# Altium schematic sheet 05_Mechanical.SchDoc: Mechanicals
size A; Revision: A; SheetNumber: 5; SheetTotal: 8; ECE315_Project_Name: ECE453 MCU Base Project
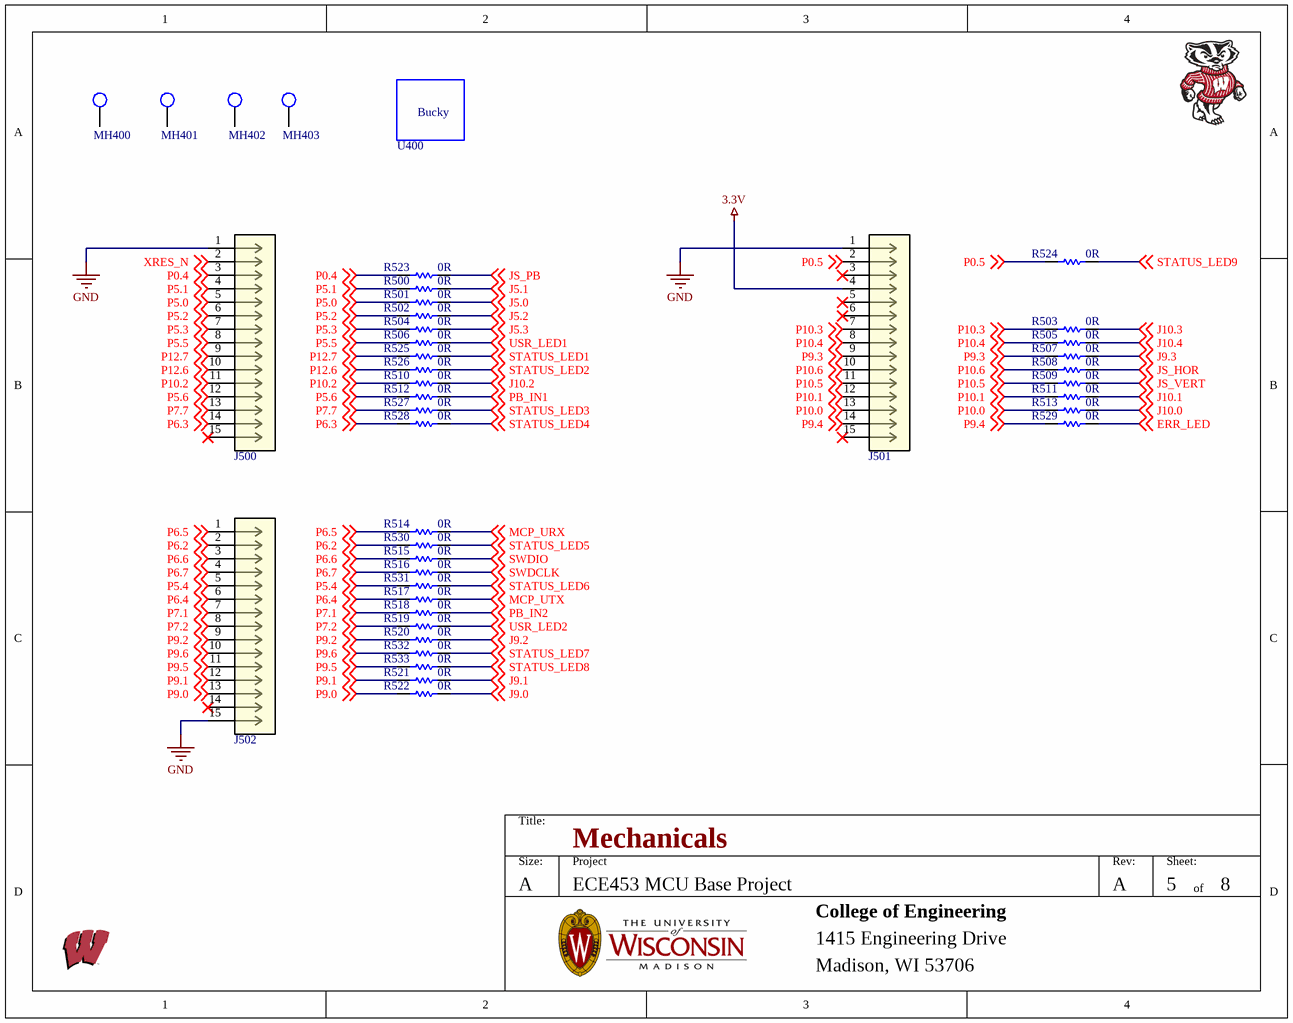
[diagram p0: 05_Mechanical.SchDoc]

## Parts
J500  68000-115HLF  [CONN_15POS_2P54MM]  (value not drawn)
J501  68000-115HLF  [CONN_15POS_2P54MM]  (value not drawn)
J502  68000-115HLF  [CONN_15POS_2P54MM]  (value not drawn)
MH400  MHOLE_2_55MM  [MHOLE_2_55MM]  (value not drawn)
MH401  MHOLE_2_55MM  [MHOLE_2_55MM]  (value not drawn)
MH402  MHOLE_2_55MM  [MHOLE_2_55MM]  (value not drawn)
MH403  MHOLE_2_55MM  [MHOLE_2_55MM]  (value not drawn)
R500  0R  [RESC2013X70X40NL20T20]
R501  0R  [RESC2013X70X40NL20T20]
R502  0R  [RESC2013X70X40NL20T20]
R503  0R  [RESC2013X70X40NL20T20]
R504  0R  [RESC2013X70X40NL20T20]
R505  0R  [RESC2013X70X40NL20T20]
R506  0R  [RESC2013X70X40NL20T20]
R507  0R  [RESC2013X70X40NL20T20]
R508  0R  [RESC2013X70X40NL20T20]
R509  0R  [RESC2013X70X40NL20T20]
R510  0R  [RESC2013X70X40NL20T20]
R511  0R  [RESC2013X70X40NL20T20]
R512  0R  [RESC2013X70X40NL20T20]
R513  0R  [RESC2013X70X40NL20T20]
R514  0R  [RESC2013X70X40NL20T20]
R515  0R  [RESC2013X70X40NL20T20]
R516  0R  [RESC2013X70X40NL20T20]
R517  0R  [RESC2013X70X40NL20T20]
R518  0R  [RESC2013X70X40NL20T20]
R519  0R  [RESC2013X70X40NL20T20]
R520  0R  [RESC2013X70X40NL20T20]
R521  0R  [RESC2013X70X40NL20T20]
R522  0R  [RESC2013X70X40NL20T20]
R523  0R  [RESC2013X70X40NL20T20]
R524  0R  [RESC2013X70X40NL20T20]
R525  0R  [RESC2013X70X40NL20T20]
R526  0R  [RESC2013X70X40NL20T20]
R527  0R  [RESC2013X70X40NL20T20]
R528  0R  [RESC2013X70X40NL20T20]
R529  0R  [RESC2013X70X40NL20T20]
R530  0R  [RESC2013X70X40NL20T20]
R531  0R  [RESC2013X70X40NL20T20]
R532  0R  [RESC2013X70X40NL20T20]
R533  0R  [RESC2013X70X40NL20T20]
U400  Bucky  [WalkingBucky]  (value not drawn)  (no BOM)

## Nets
3.3V: J501.4
GND: J500.1 J501.1 J502.15
ERR_LED: R529.2 ; off-sheet ERR_LED
J5.0: R501.2 ; off-sheet J5.0
J5.1: R500.2 ; off-sheet J5.1
J5.2: R502.2 ; off-sheet J5.2
J5.3: R504.2 ; off-sheet J5.3
J9.0: R522.2 ; off-sheet J9.0
J9.1: R521.2 ; off-sheet J9.1
J9.2: R520.2 ; off-sheet J9.2
J9.3: R507.2 ; off-sheet J9.3
J10.0: R513.2 ; off-sheet J10.0
J10.1: R511.2 ; off-sheet J10.1
J10.2: R510.2 ; off-sheet J10.2
J10.3: R503.2 ; off-sheet J10.3
J10.4: R505.2 ; off-sheet J10.4
JS_HOR: R508.2 ; off-sheet JS_HOR
JS_PB: R523.2 ; off-sheet JS_PB
JS_VERT: R509.2 ; off-sheet JS_VERT
MCP_URX: R514.2 ; off-sheet MCP_URX
MCP_UTX: R517.2 ; off-sheet MCP_UTX
P0.4: J500.3 R523.1 ; off-sheet P0.4
P0.5: J501.2 R524.1 ; off-sheet P0.5
P5.0: J500.5 R501.1 ; off-sheet P5.0
P5.1: J500.4 R500.1 ; off-sheet P5.1
P5.2: J500.6 R502.1 ; off-sheet P5.2
P5.3: J500.7 R504.1 ; off-sheet P5.3
P5.4: J502.5 R531.1 ; off-sheet P5.4
P5.5: J500.8 R506.1 ; off-sheet P5.5
P5.6: J500.12 R512.1 ; off-sheet P5.6
P6.2: J502.2 R530.1 ; off-sheet P6.2
P6.3: J500.14 R528.1 ; off-sheet P6.3
P6.4: J502.6 R517.1 ; off-sheet P6.4
P6.5: J502.1 R514.1 ; off-sheet P6.5
P6.6: J502.3 R515.1 ; off-sheet P6.6
P6.7: J502.4 R516.1 ; off-sheet P6.7
P7.1: J502.7 R518.1 ; off-sheet P7.1
P7.2: J502.8 R519.1 ; off-sheet P7.2
P7.7: J500.13 R527.1 ; off-sheet P7.7
P9.0: J502.13 R522.1 ; off-sheet P9.0
P9.1: J502.12 R521.1 ; off-sheet P9.1
P9.2: J502.9 R520.1 ; off-sheet P9.2
P9.3: J501.9 R507.1 ; off-sheet P9.3
P9.4: J501.14 R529.1 ; off-sheet P9.4
P9.5: J502.11 R533.1 ; off-sheet P9.5
P9.6: J502.10 R532.1 ; off-sheet P9.6
P10.0: J501.13 R513.1 ; off-sheet P10.0
P10.1: J501.12 R511.1 ; off-sheet P10.1
P10.2: J500.11 R510.1 ; off-sheet P10.2
P10.3: J501.7 R503.1 ; off-sheet P10.3
P10.4: J501.8 R505.1 ; off-sheet P10.4
P10.5: J501.11 R509.1 ; off-sheet P10.5
P10.6: J501.10 R508.1 ; off-sheet P10.6
P12.6: J500.10 R526.1 ; off-sheet P12.6
P12.7: J500.9 R525.1 ; off-sheet P12.7
PB_IN1: R512.2 ; off-sheet PB_IN1
PB_IN2: R518.2 ; off-sheet PB_IN2
STATUS_LED1: R525.2 ; off-sheet STATUS_LED1
STATUS_LED2: R526.2 ; off-sheet STATUS_LED2
STATUS_LED3: R527.2 ; off-sheet STATUS_LED3
STATUS_LED4: R528.2 ; off-sheet STATUS_LED4
STATUS_LED5: R530.2 ; off-sheet STATUS_LED5
STATUS_LED6: R531.2 ; off-sheet STATUS_LED6
STATUS_LED7: R532.2 ; off-sheet STATUS_LED7
STATUS_LED8: R533.2 ; off-sheet STATUS_LED8
STATUS_LED9: R524.2 ; off-sheet STATUS_LED9
SWDCLK: R516.2 ; off-sheet SWDCLK
SWDIO: R515.2 ; off-sheet SWDIO
USR_LED1: R506.2 ; off-sheet USR_LED1
USR_LED2: R519.2 ; off-sheet USR_LED2
XRES_N: J500.2 ; off-sheet XRES_N

Not connected (* = marked no-connect by the designer): J500 15*; J501 3* 5* 6* 15*; J502 14*; MH400 1; MH401 1; MH402 1; MH403 1

## Notes on the sheet
- Title:
- Size:
- A
- Project
- Rev:
- Sheet:
- of
- College of Engineering
- 1415 Engineering Drive
- Madison, WI 53706

## Library data of the parts
J500-J502 = CONN_HEADER_POS_30_2.54MM: Conn Unshrouded Header HDR 15 POS 2.54mm Solder ST Thru-Hole; Mfr_Name: Amphenol ICC; Manufacturer: Adam Equipment; Manufacturer Part Number: PH1-15-UA; Copyright: Copyright (C) 2024 Ultra Librarian. All rights reserved.; Manufacturer_Part_Number: 68000-115HLF; RefDes: RefDes; Type: DEV; Supplier: Digikey; Supplier Part Number: 2057-PH1-15-UA-ND; RoHS: No; Category: Connectors; Stock: 2835; Pricing: 1=0.18, 10=0.15, 100=0.1157, 500=0.09788, 1000=0.08008, 5000=0.07118, 10000=0.06451 (USD)
MH400-MH403 = MHOLE_2_55MM: Mounting Holde; Manufacturer Part Number: UW MTHOLE
R500-R533 = CMP-1665-00002-5: Chip Resistor, 0 Ohm, +/- 1%, 0.125 W, -55 to 155 degC, 0805 (2012 Metric), RoHS, Tape and Reel; PartNumber: ERJ-6GEY0R00V; Tolerance: 5%; Resistance: 0 Ohm; REACH SVHC: No SVHC; Min Operating Temperature: -55 degC; Case/Package: 0805; Packaging: Tape and Reel; Package Quantity: 5000; ComponentLink1Description: Manufacturer URL; PackageDescription: 2-Pin Surface Mount Device, Body 2 x 1.25 mm; Mounting Technology: Surface Mount; Max Operating Temperature: 155 degC; Width: 1.25 mm; RoHSCompliant: True; Height: 0.6 mm; ComponentLink1URL: http://www.panasonic.com/; ComponentLink2URL: http://industrial.panasonic.com/cdbs/www-data/pdf/RDA0000/AOA0000C84.pdf; Case Code (Imperial): 0805; DatasheetVersion: 03/2015; Length: 2 mm; Case Code (Metric): 2012; ComponentLink2Description: Datasheet; Radiation Hardening: No
U400 = Bucky: Bucky Badger Image; Manufacturer Part Number: UW Bucky